# Altium project ATMEGA128.PRJPCB
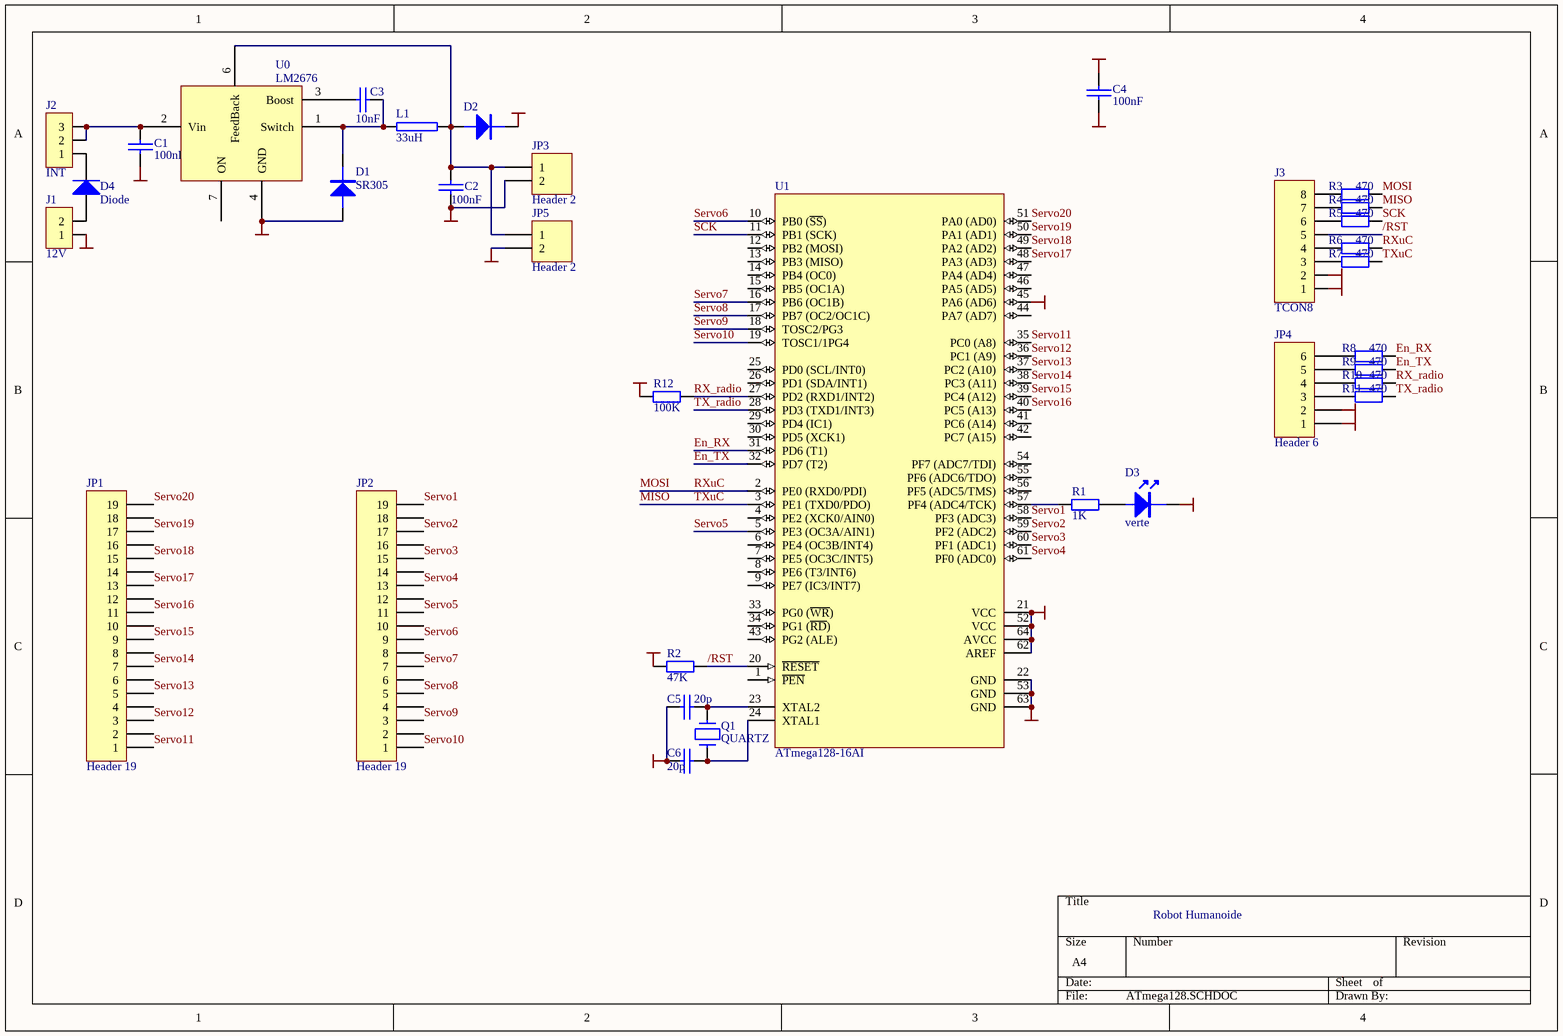
[diagram p0: ATmega128.SCHDOC]
1 sheet, 34 parts. Net scope: global (net labels, ports and power ports of the same name join across sheets).
Board file: ATmega128.PCBDOC

## Sheet ATmega128.SCHDOC
size A4

### Parts
C1  100nF  [0805]
C2  100nF  [0805]
C3  10nF  [0805]
C4  100nF  [0805]
C5  20p  [0805]
C6  20p  [0805]
D1  SR305  [1812]
D2  (no value)  [1812]
D3  verte  [0603]
D4  Diode  [DSO-C2/X3.3]
J1  12V  [CON2]
J2  INT  [TSIP3]
J3  TCON8  [TSIP8]
JP1  Header 19  [HDR1X19]
JP2  Header 19  [HDR1X19]
JP3  Header 2  [HDR1X2]
JP4  Header 6  [TSIP6]
JP5  Header 2  [HDR1X2]
L1  33uH  [TRES]
Q1  QUARTZ  [XTAL1]
R1  value 1K  [0805]  (hidden comment: Res2)
R2  value 47K  [0805]  (hidden comment: Res2)
R3  value 470  [0805]  (hidden comment: Res2)
R4  value 470  [0805]  (hidden comment: Res2)
R5  value 470  [0805]  (hidden comment: Res2)
R6  value 470  [0805]  (hidden comment: Res2)
R7  value 470  [0805]  (hidden comment: Res2)
R8  value 470  [0805]  (hidden comment: Res2)
R9  value 470  [0805]  (hidden comment: Res2)
R10  value 470  [0805]  (hidden comment: Res2)
R11  value 470  [0805]  (hidden comment: Res2)
R12  value 100K  [0805]  (hidden comment: Res2)
U0  LM2676  [LM2676]
U1  ATmega128-16AI  [64A]

### Nets
5V: C4.2 D2.1 J3.1 JP4.1 R2.2 R12.2 U1.21(VCC) U1.52(VCC) U1.62(AREF) U1.64(AVCC)
GND: C1.1 C2.1 C4.1 C5.2 C6.2 D1.2 D3.2 J1.1 J3.2 JP3.2 JP4.2 JP5.2 U0.4(GND) U1.22(GND) U1.45(PA6_(AD6)) U1.53(GND) U1.63(GND)
/RST: J3.5 R2.1 U1.20(~{RESET})
En_RX: R8.2 U1.31(PD6_(T1))
En_TX: R9.2 U1.32(PD7_(T2))
MISO: R4.2 R7.2 U1.3(PE1_(TXD0/PDO))  [also labelled TXuC]
MOSI: R3.2 R6.2 U1.2(PE0_(RXD0/PDI))  [also labelled RXuC]
RX_radio: R10.2 R12.1 U1.27(PD2_(RXD1/INT2))
SCK: R5.2 U1.11(PB1_(SCK))
Servo1: JP2.19 U1.58(PF3_(ADC3))
Servo2: JP2.17 U1.59(PF2_(ADC2))
Servo3: JP2.15 U1.60(PF1_(ADC1))
Servo4: JP2.13 U1.61(PF0_(ADC0))
Servo5: JP2.11 U1.5(PE3_(OC3A/AIN1))
Servo6: JP2.9 U1.10(PB0_(~{SS}))
Servo7: JP2.7 U1.16(PB6_(OC1B))
Servo8: JP2.5 U1.17(PB7_(OC2/OC1C))
Servo9: JP2.3 U1.18(TOSC2/PG3)
Servo10: JP2.1 U1.19(TOSC1/1PG4)
Servo11: JP1.1 U1.35(PC0_(A8))
Servo12: JP1.3 U1.36(PC1_(A9))
Servo13: JP1.5 U1.37(PC2_(A10))
Servo14: JP1.7 U1.38(PC3_(A11))
Servo15: JP1.9 U1.39(PC4_(A12))
Servo16: JP1.11 U1.40(PC5_(A13))
Servo17: JP1.13 U1.48(PA3_(AD3))
Servo18: JP1.15 U1.49(PA2_(AD2))
Servo19: JP1.17 U1.50(PA1_(AD1))
Servo20: JP1.19 U1.51(PA0_(AD0))
TX_radio: R11.2 U1.28(PD3_(TXD1/INT3))
NetC1_2: C1.2 J2.2 J2.3 U0.2(Vin)
NetC2_2: C2.2 D2.2 JP3.1 JP5.1 L1.2 U0.6(FeedBack)
NetC3_1: C3.1 U0.3(Boost)
NetC3_2: C3.2 D1.1 L1.1 U0.1(Switch)
NetC5_1: C5.1 Q1.1 U1.23(XTAL2)
NetC6_1: C6.1 Q1.2 U1.24(XTAL1)
NetD3_1: D3.1 R1.1
NetD4_1: D4.1(A) J1.2
NetD4_2: D4.2(K) J2.1
NetJ3_3: J3.3 R7.1
NetJ3_4: J3.4 R6.1
NetJ3_6: J3.6 R5.1
NetJ3_7: J3.7 R4.1
NetJ3_8: J3.8 R3.1
NetJP4_3: JP4.3 R11.1
NetJP4_4: JP4.4 R10.1
NetJP4_5: JP4.5 R9.1
NetJP4_6: JP4.6 R8.1
NetR1_2: R1.2 U1.57(PF4_(ADC4/TCK))

Not connected (* = marked no-connect by the designer): JP1 2 4 6 8 10 12 14 16 18; JP2 2 4 6 8 10 12 14 16 18; U0 7(ON); U1 1(~{PEN}) 4(PE2_(XCK0/AIN0)) 6(PE4_(OC3B/INT4)) 7(PE5_(OC3C/INT5)) 8(PE6_(T3/INT6)) 9(PE7_(IC3/INT7)) 12(PB2_(MOSI)) 13(PB3_(MISO)) 14(PB4_(OC0)) 15(PB5_(OC1A)) 25(PD0_(SCL/INT0)) 26(PD1_(SDA/INT1)) 29(PD4_(IC1)) 30(PD5_(XCK1)) 33(PG0_(~{WR})) 34(PG1_(~{RD})) 41(PC6_(A14)) 42(PC7_(A15)) 43(PG2_(ALE)) 44(PA7_(AD7)) 46(PA5_(AD5)) 47(PA4_(AD4)) 54(PF7_(ADC7/TDI)) 55(PF6_(ADC6/TDO)) 56(PF5_(ADC5/TMS))

### Notes on the sheet
- Robot Humanoide

### Library data of the parts
C1 C2 C4 = CAP: Part Field 1: 08/06/2000; Part Field 2: Altium Hobart Technology Centre; Part Field 3: Generic Components; Part Field 4: Passive; Part Field 5: Capacitor
C3 C5 C6 = CONDO
D1 D2 = DIODE
D3 = LED
D4 = Diode: Default Diode; Code - JEDEC: DO-214-AB; Published: 8-Jun-2000; Revision: July-2002: Re-released for DXP Platform.; Publisher: Altium Limited
J1 = CON2
J2 = TCON3
JP1 JP2 = Header 19: Header, 19-Pin; Revision: 17-Jul-2002: Re-released for DXP Platform.; Publisher: Altium Limited
JP3 JP5 = Header 2: Header, 2-Pin; Revision: 17-Jul-2002: Re-released for DXP Platform.; Publisher: Altium Limited
JP4 = Header 6: Header, 6-Pin; Revision: 17-Jul-2002: Re-released for DXP Platform.; Publisher: Altium Limited
L1 = RES2: Published: *; Publisher: *; Manufacturer: *; Class: *; SubClass: *
R1-R12 = Res2: Resistor; Published: 8-Jun-2000; Revision: July-2002: Re-released for DXP Platform.; Publisher: Altium Limited
U1 = ATmega128-16AI: 8-Bit AVR Microcontroller with 128K Bytes of In-System Programmable Flash Memory; PackageDocument: revB, Oct-2001; Published: 17-Sep-2003; LatestRevisionDate: 15-Nov-2004; LatestRevisionNote: Pin 3 name changed to 'PE1 (TXD0/PDO)'.; DatasheetDocument: 2467G-AVR-09/02; PackageReference: 64A; Publisher: Altium Limited; Code_JEDEC: MS-026-AEB